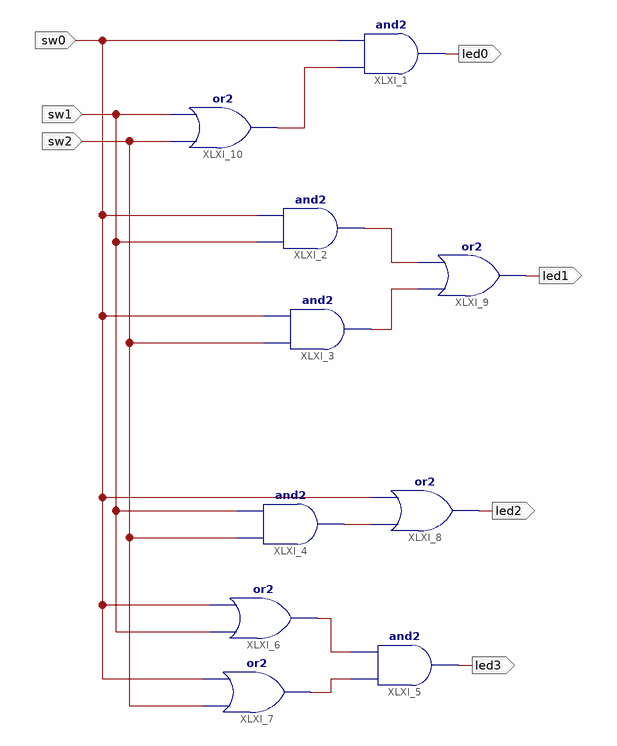
[diagram p0: schematic sheet 1]
// Xilinx ISE schematic tema_1b.sch (spartan3e) as structural Verilog: 10 symbols, 7 ports
module tema_1b (
  input  sw0,
  input  sw1,
  input  sw2,
  output led0,
  output led1,
  output led2,
  output led3
);

  wire XLXN_1, XLXN_2, XLXN_3, XLXN_4, XLXN_5, XLXN_6;

  and XLXI_1 (led0, XLXN_1, sw0);
  and XLXI_2 (XLXN_2, sw1, sw0);
  and XLXI_3 (XLXN_3, sw2, sw0);
  or XLXI_9 (led1, XLXN_3, XLXN_2);
  or XLXI_10 (XLXN_1, sw2, sw1);
  and XLXI_4 (XLXN_4, sw2, sw1);
  and XLXI_5 (led3, XLXN_6, XLXN_5);
  or XLXI_6 (XLXN_5, sw1, sw0);
  or XLXI_7 (XLXN_6, sw2, sw0);
  or XLXI_8 (led2, XLXN_4, sw0);
endmodule
